# EAGLE design panel (EAGLE 7.2.0)
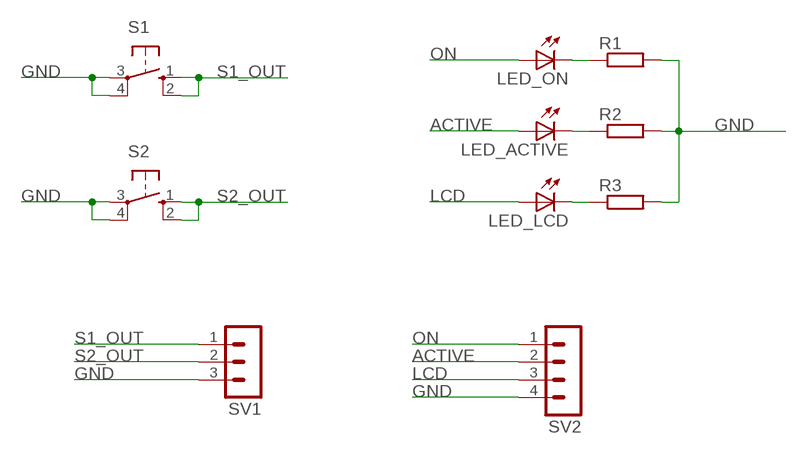
[diagram p0: schematic, sheet 1]

## Parts
LED_ACTIVE  LED_ELD260  [LED_LD260]
LED_LCD  LED_ELD260  [LED_LD260]
LED_ON  LED_ELD260  [LED_LD260]
R1  R-EU_R1206  [R1206]
R2  R-EU_R1206  [R1206]
R3  R-EU_R1206  [R1206]
S1  10-XX  [B3F-10XX]
S2  10-XX  [B3F-10XX]
SV1  MA03-1  [MA03-1]
SV2  MA04-1  [MA04-1]

## Nets
ACTIVE: LED_ACTIVE.A SV2.2
GND: R1.2 R2.2 R3.2 S1.3(P) S1.4(P1) S2.3(P) S2.4(P1) SV1.3 SV2.4
LCD: LED_LCD.A SV2.3
N$4: LED_LCD.K(C) R3.1
N$5: LED_ACTIVE.K(C) R2.1
N$6: LED_ON.K(C) R1.1
ON: LED_ON.A SV2.1
S1_OUT: S1.1(S) S1.2(S1) SV1.1
S2_OUT: S2.1(S) S2.2(S1) SV1.2

## Library data of the parts
LED_ACTIVE LED_LCD LED_ON = eagle-ltspice:LED_E: LED Source: http://www.osram.convergy.de Source: www.luxeon.com Source: www.kingbright.com; SPICEMODEL: NONE; SPICEPREFIX: D; SPICETYPE: diode
R1-R3 = resistor:R-EU_: RESISTOR, European symbol
S1 S2 = switch-omron:10-XX: OMRON SWITCH; MPN: B3F-1000; OC_FARNELL: 176432; OC_NEWARK: 36M3542
SV1 = con-lstb:MA03-1: PIN HEADER; OC_FARNELL: unknown; OC_NEWARK: unknown
SV2 = con-lstb:MA04-1: PIN HEADER; OC_FARNELL: unknown; OC_NEWARK: unknown

## Board
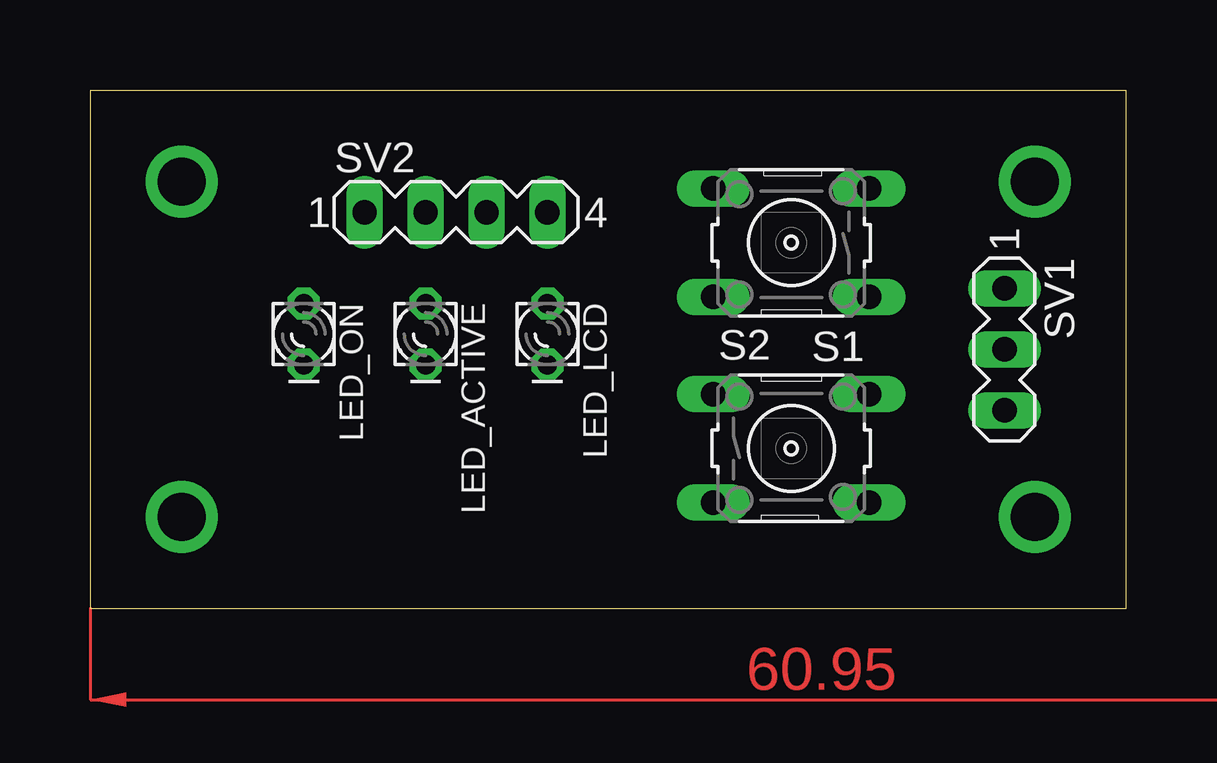
[diagram p1: board, top side]
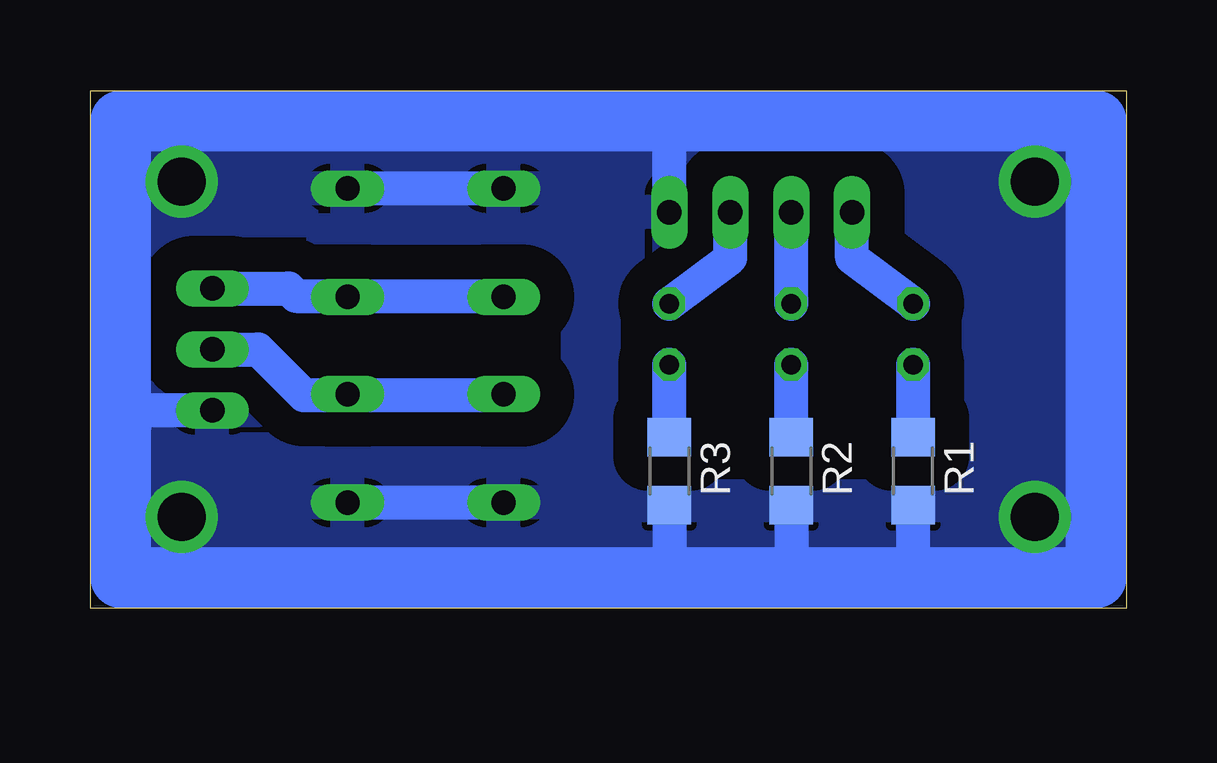
[diagram p2: board, bottom side, seen from below]

Size 43.17 x 21.58 mm. Coordinates in mm from the lower left corner, seen from the top.
Outline: 0,0 43.17,0 43.17,21.58 0,21.58 0,0
Copper layers (1*16): Top 0.035mm / dielectric 1.5mm / Bottom 0.035mm
Design rules "default": minimum track width 10mil, minimum drill 24mil, track to track 8mil, track to pad 8mil, pad to pad 8mil, via to via 8mil, smd to smd 8mil, copper to edge 40mil, drill to drill 8mil, minimum pad ring 10mil, minimum via ring 8mil, stop-mask expansion 4mil, vias tented up to drill 0mil, thermal gap 10mil

### Footprints (pad centres in the part's own frame; a part is rotated, then mirrored left to right if it is on the bottom)
LED_LD260 = drill 0.813 octagon: A -1.27,0; K 1.27,0
R1206 = smd 1.6 x 1.803: 1 -1.422,0; 2 1.422,0
B3F-10XX = drill 1.016 long: 1 -3.251,2.261; 2 3.251,2.261; 3 -3.251,-2.261; 4 3.251,-2.261
MA03-1 = drill 1.016 long: 1 -2.54,0; 2 0,0; 3 2.54,0
MA04-1 = drill 1.016 long: 1 -3.81,0; 2 -1.27,0; 3 1.27,0; 4 3.81,0

### Placement (x,y rotation side)
LED_ACTIVE  13.97,11.43 270 top
LED_LCD  19.05,11.43 270 top
LED_ON  8.89,11.43 270 top
R1  8.89,5.71 270 bottom
R2  13.97,5.71 270 bottom
R3  19.05,5.71 270 bottom
S1  29.21,15.24 180 top
S2  29.21,6.67 0 top
SV1  38.1,10.79 270 top
SV2  15.24,16.51 0 top

### Tracks (layer width: path | path; a pad name or v marks a point on that pad's centre or on a via)
ACTIVE
  Bottom 1.422: LED_ACTIVE.A SV2.2
GND  (via drill 2)
  Bottom 1.422: SV2.4 19.05,20.32 | R1.2 8.89,1.27 | R2.2 13.97,1.27 | R3.2 19.05,1.27 | S2.4 S2.3 | SV1.3 41.91,8.26 41.91,7.62 | S1.4 S1.3
  Bottom 2.54: 19.05,20.32 1.27,20.32 1.27,1.27 8.89,1.27 13.97,1.27 19.05,1.27 41.91,1.27 41.91,7.62 41.91,20.32 19.05,20.32
  other vias: 3.81,3.81 3.81,17.78 39.37,17.78 39.37,3.81
  pour Bottom (isolate 1.422): -1.27,22.86 44.45,22.86 44.45,-1.27 -1.27,-1.27
LCD
  Bottom 1.422: LED_LCD.A 16.51,14.61 SV2.3
N$4
  Bottom 1.422: R3.1 LED_LCD.K
N$5
  Bottom 1.422: R2.1 LED_ACTIVE.K
N$6
  Bottom 1.422: LED_ON.K R1.1
ON
  Bottom 1.422: LED_ON.A 11.43,14.61 SV2.1
S1_OUT
  Bottom 1.422: SV1.1 34.92,13.33 34.61,13.02 32.46,13.02 | 32.46,13.02 S1.1 | 32.46,13.02 25.96,13.02 S1.2
S2_OUT
  Bottom 1.422: SV1.2 36.19,10.79 34.29,8.89 32.46,8.89 | 32.46,8.89 S2.2 | 32.46,8.89 25.96,8.89 S2.1
(copper drawn outside any net)
  shapes: Top area x2